# Altium schematic sheet Pin Expander 595.SchDoc
size A4
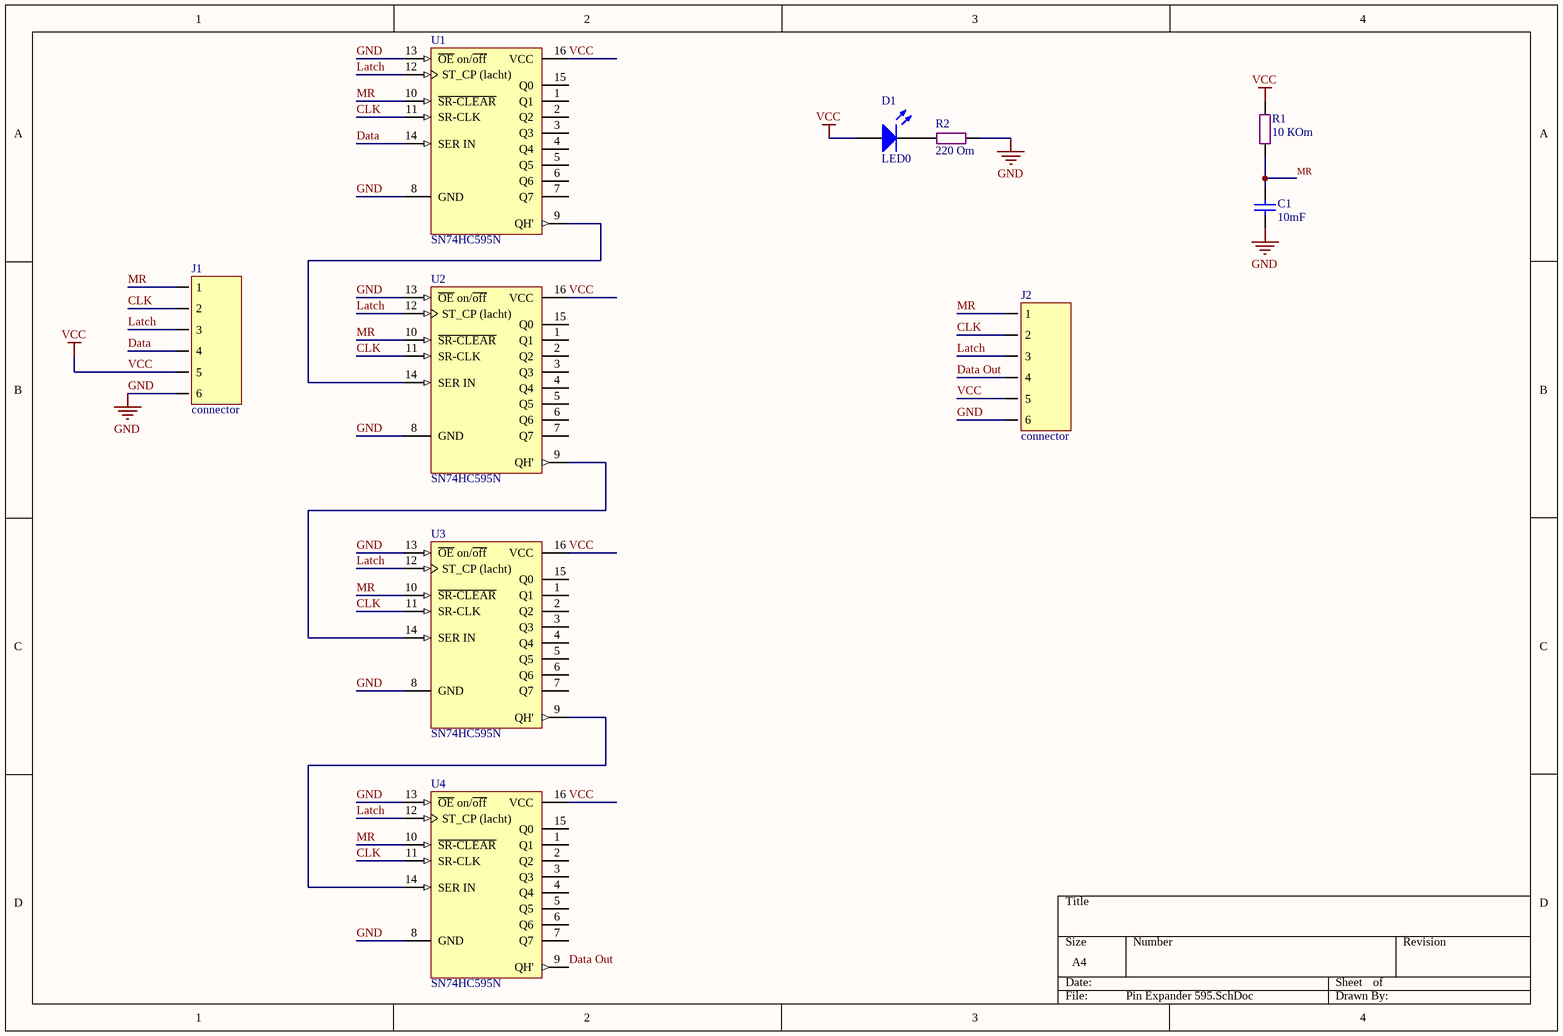
[diagram p0: Pin Expander 595.SchDoc]

## Parts
C1  10mF  [Cap p2.54mm (2p)]
D1  LED0  [LED-0]
J1  connector  [Line 2.54 x 6]
J2  connector  [Line 2.54 x 6]
R1  10 КOm  [Res p7.62 (4p)]
R2  220 Om  [Res p7.62 (4p)]
U1  SN74HC595N  [DIP16]
U2  SN74HC595N  [DIP16]
U3  SN74HC595N  [DIP16]
U4  SN74HC595N  [DIP16]

## Nets
GND: C1.1 J1.6 J2.6 R2.2 U1.8(GND) U1.13(~{OE}_on/~{off}) U2.8(GND) U2.13(~{OE}_on/~{off}) U3.8(GND) U3.13(~{OE}_on/~{off}) U4.8(GND) U4.13(~{OE}_on/~{off})
VCC: D1.1(A) J1.5 J2.5 R1.1 U1.16(VCC) U2.16(VCC) U3.16(VCC) U4.16(VCC)
CLK: J1.2 J2.2 U1.11(SR-CLK) U2.11(SR-CLK) U3.11(SR-CLK) U4.11(SR-CLK)
Data: J1.4 U1.14(SER_IN)
Data Out: J2.4 U4.9(QH')
Latch: J1.3 J2.3 U1.12(ST_CP_(lacht)) U2.12(ST_CP_(lacht)) U3.12(ST_CP_(lacht)) U4.12(ST_CP_(lacht))
MR: C1.2 J1.1 J2.1 R1.2 U1.10(~{SR-CLEAR}) U2.10(~{SR-CLEAR}) U3.10(~{SR-CLEAR}) U4.10(~{SR-CLEAR})
NetD1_2: D1.2(K) R2.1
NetU1_9: U1.9(QH') U2.14(SER_IN)
NetU2_9: U2.9(QH') U3.14(SER_IN)
NetU3_9: U3.9(QH') U4.14(SER_IN)

Not connected (* = marked no-connect by the designer): U1 1(Q1) 2(Q2) 3(Q3) 4(Q4) 5(Q5) 6(Q6) 7(Q7) 15(Q0); U2 1(Q1) 2(Q2) 3(Q3) 4(Q4) 5(Q5) 6(Q6) 7(Q7) 15(Q0); U3 1(Q1) 2(Q2) 3(Q3) 4(Q4) 5(Q5) 6(Q6) 7(Q7) 15(Q0); U4 1(Q1) 2(Q2) 3(Q3) 4(Q4) 5(Q5) 6(Q6) 7(Q7) 15(Q0)

## Library data of the parts
C1 = Cap: Capacitor
D1 = LED0: Typical INFRARED GaAs LED; Published: 8-Jun-2000; LatestRevisionDate: 08-Jul-2005; LatestRevisionNote: Mech Layer 1 removed.; PackageReference: LED-0; Publisher: Altium Limited; PackageDescription: LED; 2 Leads
J1 J2 = Connector ( 6 pin ): 6pin Connector
R1 R2 = Resistor
U1-U4 = SN74HC595N: 8-Bit Shift Register with 3-State Output Registers; Published: 8-Jun-2000; LatestRevisionDate: 04-Mar-2005; LatestRevisionNote: Stylized 3D Model Added.; DatasheetVersion: May-1997; PackageVersion: Oct-1995; PackageReference: N016; Publisher: Altium Limited; PackageDescription: DIP; 16 Leads; Row Spacing 7.62 mm; Pitch 2.54 mm; Code_JEDEC: MS-001-BB; ComponentLink1Description: Manufacturer Link; ComponentLink1URL: http://www.ti.com/; ComponentLink2Description: Datasheet; ComponentLink2URL: http://www-s.ti.com/sc/ds/sn74hc595.pdf